# EAGLE design lazer (EAGLE 8.7.1)
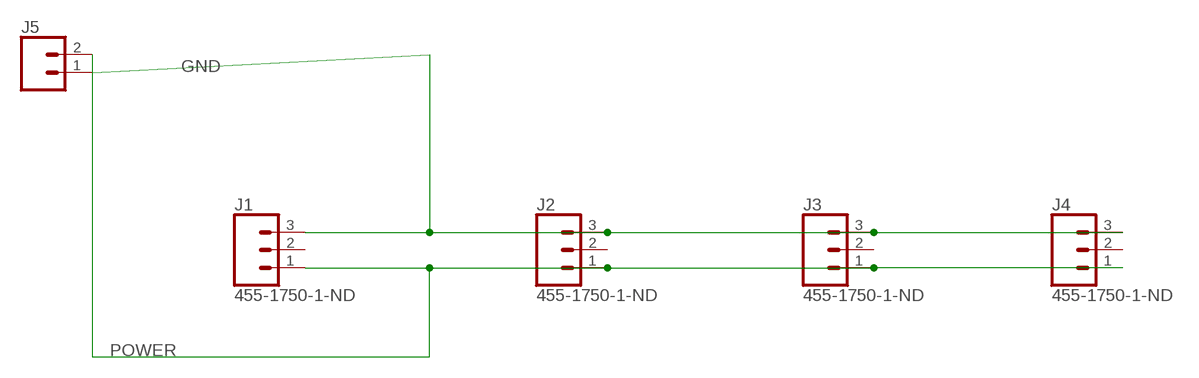
[diagram p0: schematic, sheet 1]

## Parts
J1  455-1750-1-ND  CONN_03  [1X03]
J2  455-1750-1-ND  CONN_03  [1X03]
J3  455-1750-1-ND  CONN_03  [1X03]
J4  455-1750-1-ND  CONN_03  [1X03]
J5  CONN_02  [1X02]

## Nets
GND: J1.3 J2.3 J3.3 J4.3 J5.1
POWER: J1.1 J2.1 J3.1 J4.1 J5.2
Unconnected: J1.2 J2.2 J3.2 J4.2

## Library data of the parts
J1-J4 = wendor:CONN_03: Multi connection point. Often used as Generic Header-pin footprint for 0.1 inch spaced/style header connections On any of the 0.1 inch spaced packages, you can populate with these: Break Away Headers - Straight <https://www.sparkfun.com/products/116> (PRT-00116) Break Away Male Headers - Right Angle <https://www.sparkfun.com/products/553> (PRT-00553) Female Headers <https://www.sparkfun.com/products/115> (PRT-00115) Break Away Headers - Machine Pin <https://www.sparkfun.com/products/117> (PRT-00117) Break Away Female Headers - Swiss Machine Pin <https://www.sparkfun.com/products/743> (PRT-00743) Stackable Header - 3 Pin (Female, 0.1") <https://www.sparkfun.com/products/13875> (PRT-13875) For SCREWTERMINALS and SPRING TERMINALS visit here: Screw Terimnals on SparkFun.com <https://www.sparkfun.com/search/results?term=Screw+Terminals> (5mm/3.5mm/2.54mm spacing) This device is also useful as a general connection point to wire up your design to another part of your project. Our various solder wires solder well into these plated through hole pads. Hook-Up Wire - Assortment (Stranded, 22 AWG) <https://www.sparkfun.com/products/11375> (PRT-11375) Hook-Up Wire - Assortment (Solid Core, 22 AWG) <https://www.sparkfun.com/products/11367> (PRT-11367) View the entire wire category on our website here <https://www.sparkfun.com/categories/141> Special notes: Molex polarized connector foot print use with SKU : PRT-08232 with associated crimp pins and housings.; PROD_ID: XXX-00000
J5 = wendor:CONN_02: Multi connection point. Often used as Generic Header-pin footprint for 0.1 inch spaced/style header connections On any of the 0.1 inch spaced packages, you can populate with these: Break Away Headers - Straight <https://www.sparkfun.com/products/116> (PRT-00116) Break Away Male Headers - Right Angle <https://www.sparkfun.com/products/553> (PRT-00553) Female Headers <https://www.sparkfun.com/products/115> (PRT-00115) Break Away Headers - Machine Pin <https://www.sparkfun.com/products/117> (PRT-00117) Break Away Female Headers - Swiss Machine Pin <https://www.sparkfun.com/products/743> (PRT-00743) For SCREWTERMINALS and SPRING TERMINALS visit here: Screw Terimnals on SparkFun.com <https://www.sparkfun.com/search/results?term=Screw+Terminals> (5mm/3.5mm/2.54mm spacing) This device is also useful as a general connection point to wire up your design to another part of your project. Our various solder wires solder well into these plated through hole pads. Hook-Up Wire - Assortment (Stranded, 22 AWG) <https://www.sparkfun.com/products/11375> (PRT-11375) Hook-Up Wire - Assortment (Solid Core, 22 AWG) <https://www.sparkfun.com/products/11367> (PRT-11367) View the entire wire category on our website here <https://www.sparkfun.com/categories/141> Special notes: Molex polarized connector foot print use with: PRT-08233 with associated crimp pins and housings. 2.54_SCREWTERM for use with PRT-10571. 3.5mm Screw Terminal footprints for PRT-08084 5mm Screw Terminal footprints for use with PRT-08432

## Net classes
0 default: width 1.016 mm, drill 0.508 mm, clearance 0.254 mm

## Board
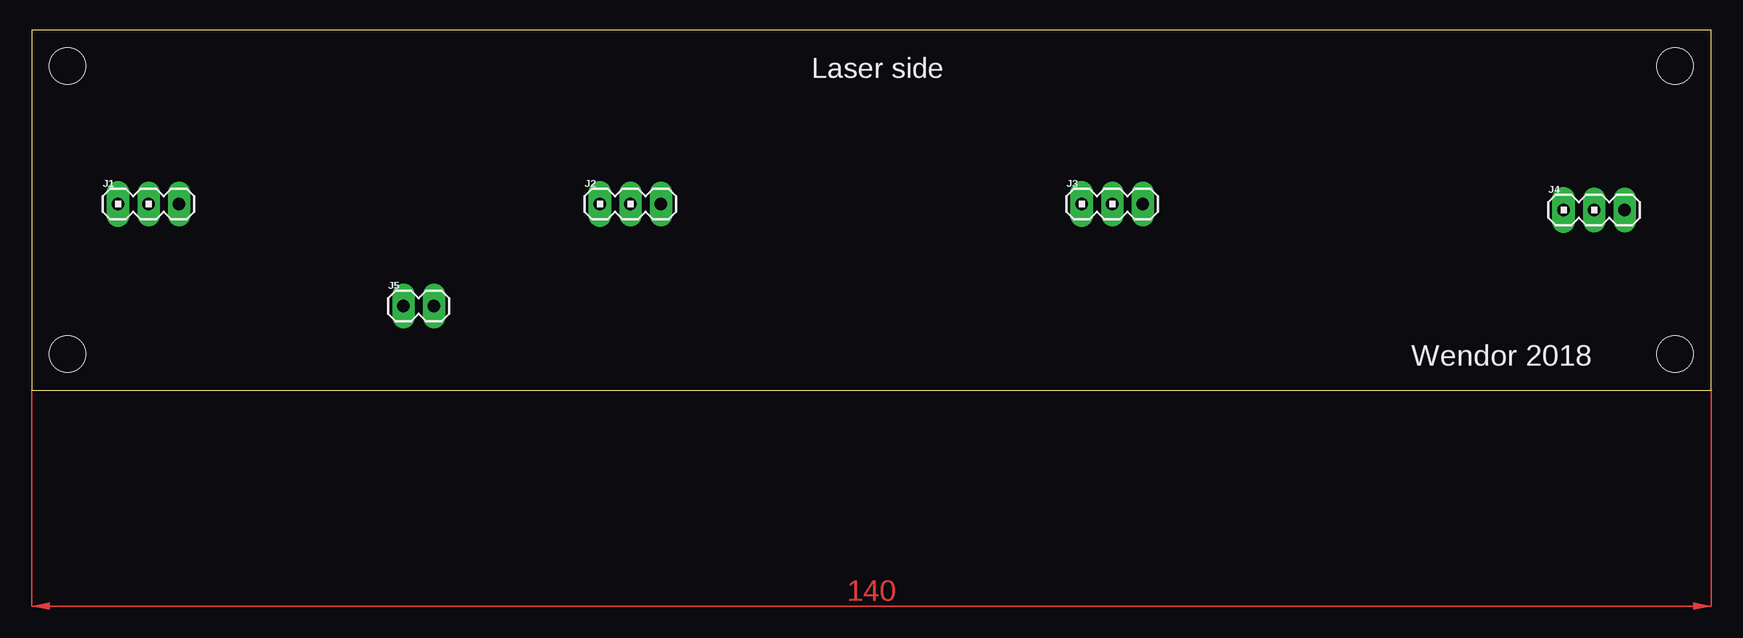
[diagram p1: board, top side]
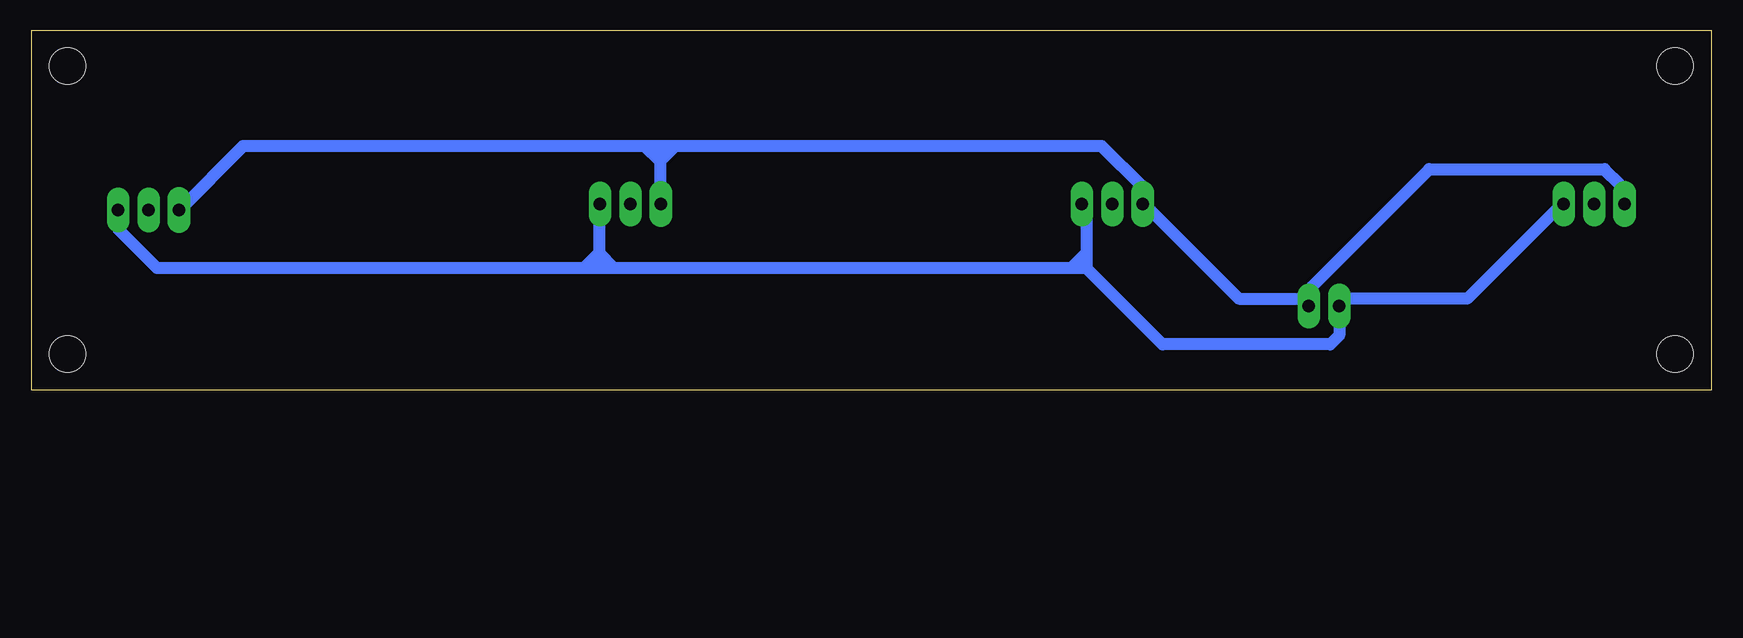
[diagram p2: board, bottom side, seen from below]

Size 140 x 30 mm. Coordinates in mm from the lower left corner, seen from the top.
Outline: 0,0 140,0 140,30 0,30 0,0
Copper layers (1*16): Top 0.035mm / dielectric 1.5mm / Bottom 0.035mm
Design rules "default": minimum track width 6mil, minimum drill 0.35mm, track to track 6mil, track to pad 6mil, pad to pad 6mil, via to via 6mil, smd to smd 6mil, copper to edge 40mil, drill to drill 6mil, minimum pad ring 10mil, minimum via ring 8mil, stop-mask expansion 4mil, vias tented up to drill 0mil, thermal gap 10mil
Holes 3 mm at 3,3 137,3 137,27 3,27

### Footprints (pad centres in the part's own frame; a part is rotated, then mirrored left to right if it is on the bottom)
1X03 = drill 1.016 pad 1.93 long: 1 -2.54,0 | drill 1.016 pad 1.88 long: 2 0,0; 3 2.54,0
1X02 = drill 1.016 pad 1.88 long: 1 0,0; 2 2.54,0

### Placement (x,y rotation side)
J1  9.75,15.5 0 top
J2  49.92,15.5 0 top
J3  90.08,15.5 0 top
J4  130.25,15 0 top
J5  31,7 0 top

### Tracks (layer width: path | path; a pad name or v marks a point on that pad's centre or on a via)
GND
  Bottom 1.016: 52.25,15.5 J2.3 52.07,15.11 52.07,11.43 | 92.5,15.5 J3.3 92.71,15.41 92.71,11.43 | J4.3 132.75,15 132.75,13.37 129.54,10.16 93.98,10.16 | J1.3 12.7,15.24 20.32,7.62 30.48,7.62 J5.1 31,4.56 31.75,3.81 45.72,3.81 50.8,8.89 52.07,10.16 | 52.07,10.16 53.34,10.16 | 53.34,10.16 91.44,10.16 | 91.44,10.16 92.71,10.16 | 92.71,10.16 93.98,10.16 | 92.71,11.43 92.71,10.16 | 91.44,10.16 92.71,11.43 | 92.71,11.43 93.98,10.16 | 52.07,11.43 52.07,10.16 | 52.07,11.43 53.34,10.16
POWER
  Bottom 1.016: 7.25,15.5 J1.1 7.62,15.88 7.62,17.14 8.89,18.41 23.5,18.41 34.29,7.62 | 34.29,7.62 39.37,7.62 46.99,15.24 J2.1 47.38,16.9 50.8,20.32 86.36,20.32 | 34.29,7.62 33.66,7.62 J5.2 34.29,7.62 | J4.1 122.39,20.32 88.9,20.32 | 86.36,20.32 87.63,20.32 | 87.63,20.32 88.9,20.32 | 87.63,20.32 87.63,19.05 | 87.63,19.05 87.63,15.59 J3.1 | 86.36,20.32 87.63,19.05 | 87.63,19.05 88.9,20.32
(copper drawn outside any net)
  shapes: Top area x1

### Text on the board
tNames: Laser side | Wendor 2018